# Altium schematic sheet Thermistor.SchDoc
size 209 x 297 mm; Address1: Address1; Address2: Address2; Address3: Address3; Address4: Address4; DocumentNumber: *Э3; SheetNumber: 3; SheetTotal: 11; DocumentType: Схема электрическая *
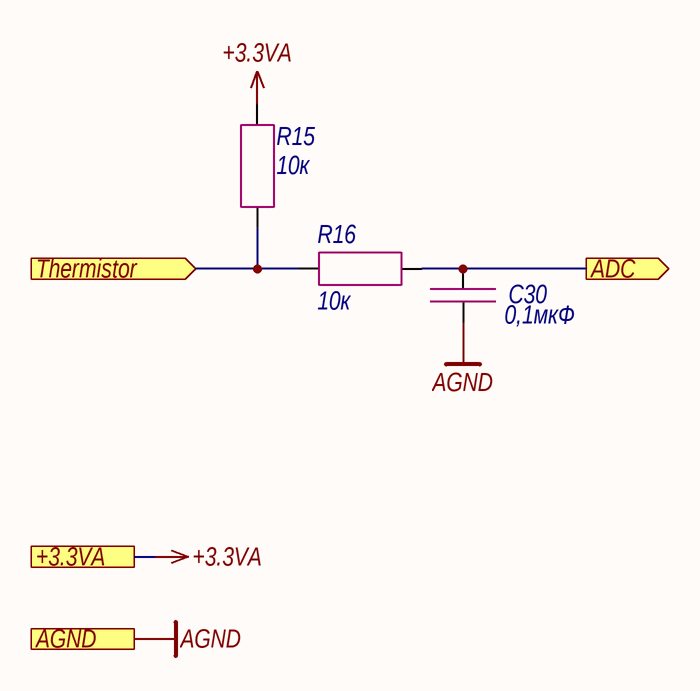
[diagram p0: Thermistor.SchDoc]

## Parts
C30  0,1мкФ  [CAP_0603]
R15  10к  [RES_0603]
R16  10к  [RES_0603]

## Ports
+3.3VA (see Main[1A], Hardwiring[4D], LD_driver[2D]), ADC (out, see Main[2A]), AGND (see Main[1B], Hardwiring[4D], LD_driver[2D], Photodiode[1C]), Thermistor (in, see Main[1A])

## Nets
+3.3VA: R15.1 ; port +3.3VA
AGND: C30.2 ; port AGND
ADC: C30.1 R16.2 ; port ADC
Thermistor: R15.2 R16.1 ; port Thermistor

## Notes on the sheet
- Подп. и дата
- Инв. № дубл.
- Взам. инв. №
- Инв. № подл.
- Изм.
- Лист
- № докум.
- Подп.
- Дата
- Копировал
- Формат А4

## Library data of the parts
C30 = Capacitor: Manufacturer: Murata; Model: GRM188R71H104KA93D; Value: 0,1мкФ; Document: *
R15 R16 = Resistor: Manufacturer: Yageo; Model: RC0603FR-0710KL; Value: 10к; Document: *